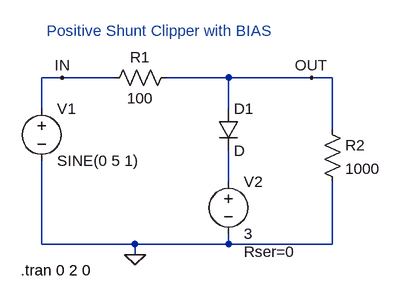
[diagram p0: schematic Positive Shunt Clipper with BIAS.asc]
Positive Shunt Clipper with BIAS.asc, the LTspice schematic file:
Version 4
SHEET 1 880 680
WIRE 32 80 0 80
WIRE 112 80 32 80
WIRE 288 80 192 80
WIRE 416 80 288 80
WIRE 448 80 416 80
WIRE 0 128 0 80
WIRE 288 128 288 80
WIRE 448 160 448 80
WIRE 288 240 288 192
WIRE 0 336 0 208
WIRE 144 336 0 336
WIRE 288 336 288 320
WIRE 288 336 144 336
WIRE 448 336 448 240
WIRE 448 336 288 336
WIRE 144 352 144 336
FLAG 144 352 0
FLAG 32 80 IN
FLAG 416 80 OUT
SYMBOL diode 272 128 R0
SYMATTR InstName D1
SYMBOL voltage 0 112 R0
WINDOW 123 0 0 Left 0
WINDOW 39 0 0 Left 0
SYMATTR InstName V1
SYMATTR Value SINE(0 5 1)
SYMBOL voltage 288 224 R0
WINDOW 123 0 0 Left 0
WINDOW 39 24 124 Left 2
SYMATTR SpiceLine Rser=0
SYMATTR InstName V2
SYMATTR Value 3
SYMBOL res 96 96 R270
WINDOW 0 32 56 VTop 2
WINDOW 3 0 56 VBottom 2
SYMATTR InstName R1
SYMATTR Value 100
SYMBOL res 432 144 R0
SYMATTR InstName R2
SYMATTR Value 1000
TEXT -32 376 Left 2 !.tran 0 2 0
TEXT 8 8 Left 2 ;Positive Shunt Clipper with BIAS

The netlist it stands for:
* Positive Shunt Clipper with BIAS.asc
D1 OUT N001 D
V1 IN 0 SINE(0 5 1)
V2 N001 0 3 Rser=0
R1 IN OUT 100
R2 OUT 0 1000
.model D D
.lib standard.dio
.tran 0 2 0
* Positive Shunt Clipper with BIAS
.backanno
.end

* Results of the author's LTspice run, read from the files saved beside the schematic
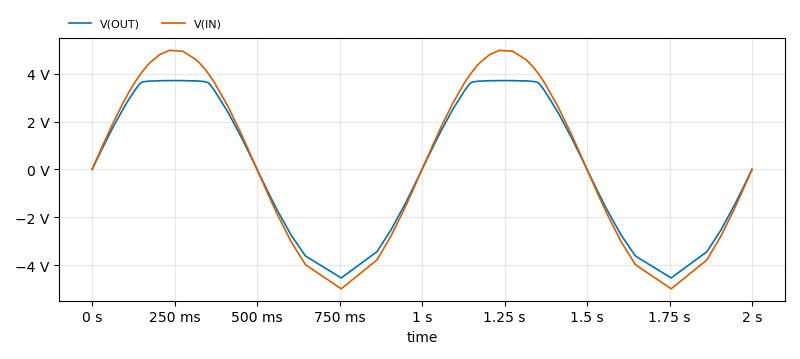
[diagram p1: Transient Analysis of Positive Shunt Clipper with BIAS.asc, plotted from the saved traces]
* Transient Analysis, 1 run:
*   V(OUT): min -4.537 V, max 3.712 V, average -74.1 mV, rms 3.035 V, last 0 V
*   V(IN): min -4.991 V, max 4.976 V, average 38.01 mV, rms 3.493 V, last 0 V